# EasyEDA schematic SCH_闹钟_2022-10-18.json
TITLE: Sheet_1; REV: 1.0; Date: 2022-10-18; Sheet: 1/1; Drawn By: 小周; Company: Your Company
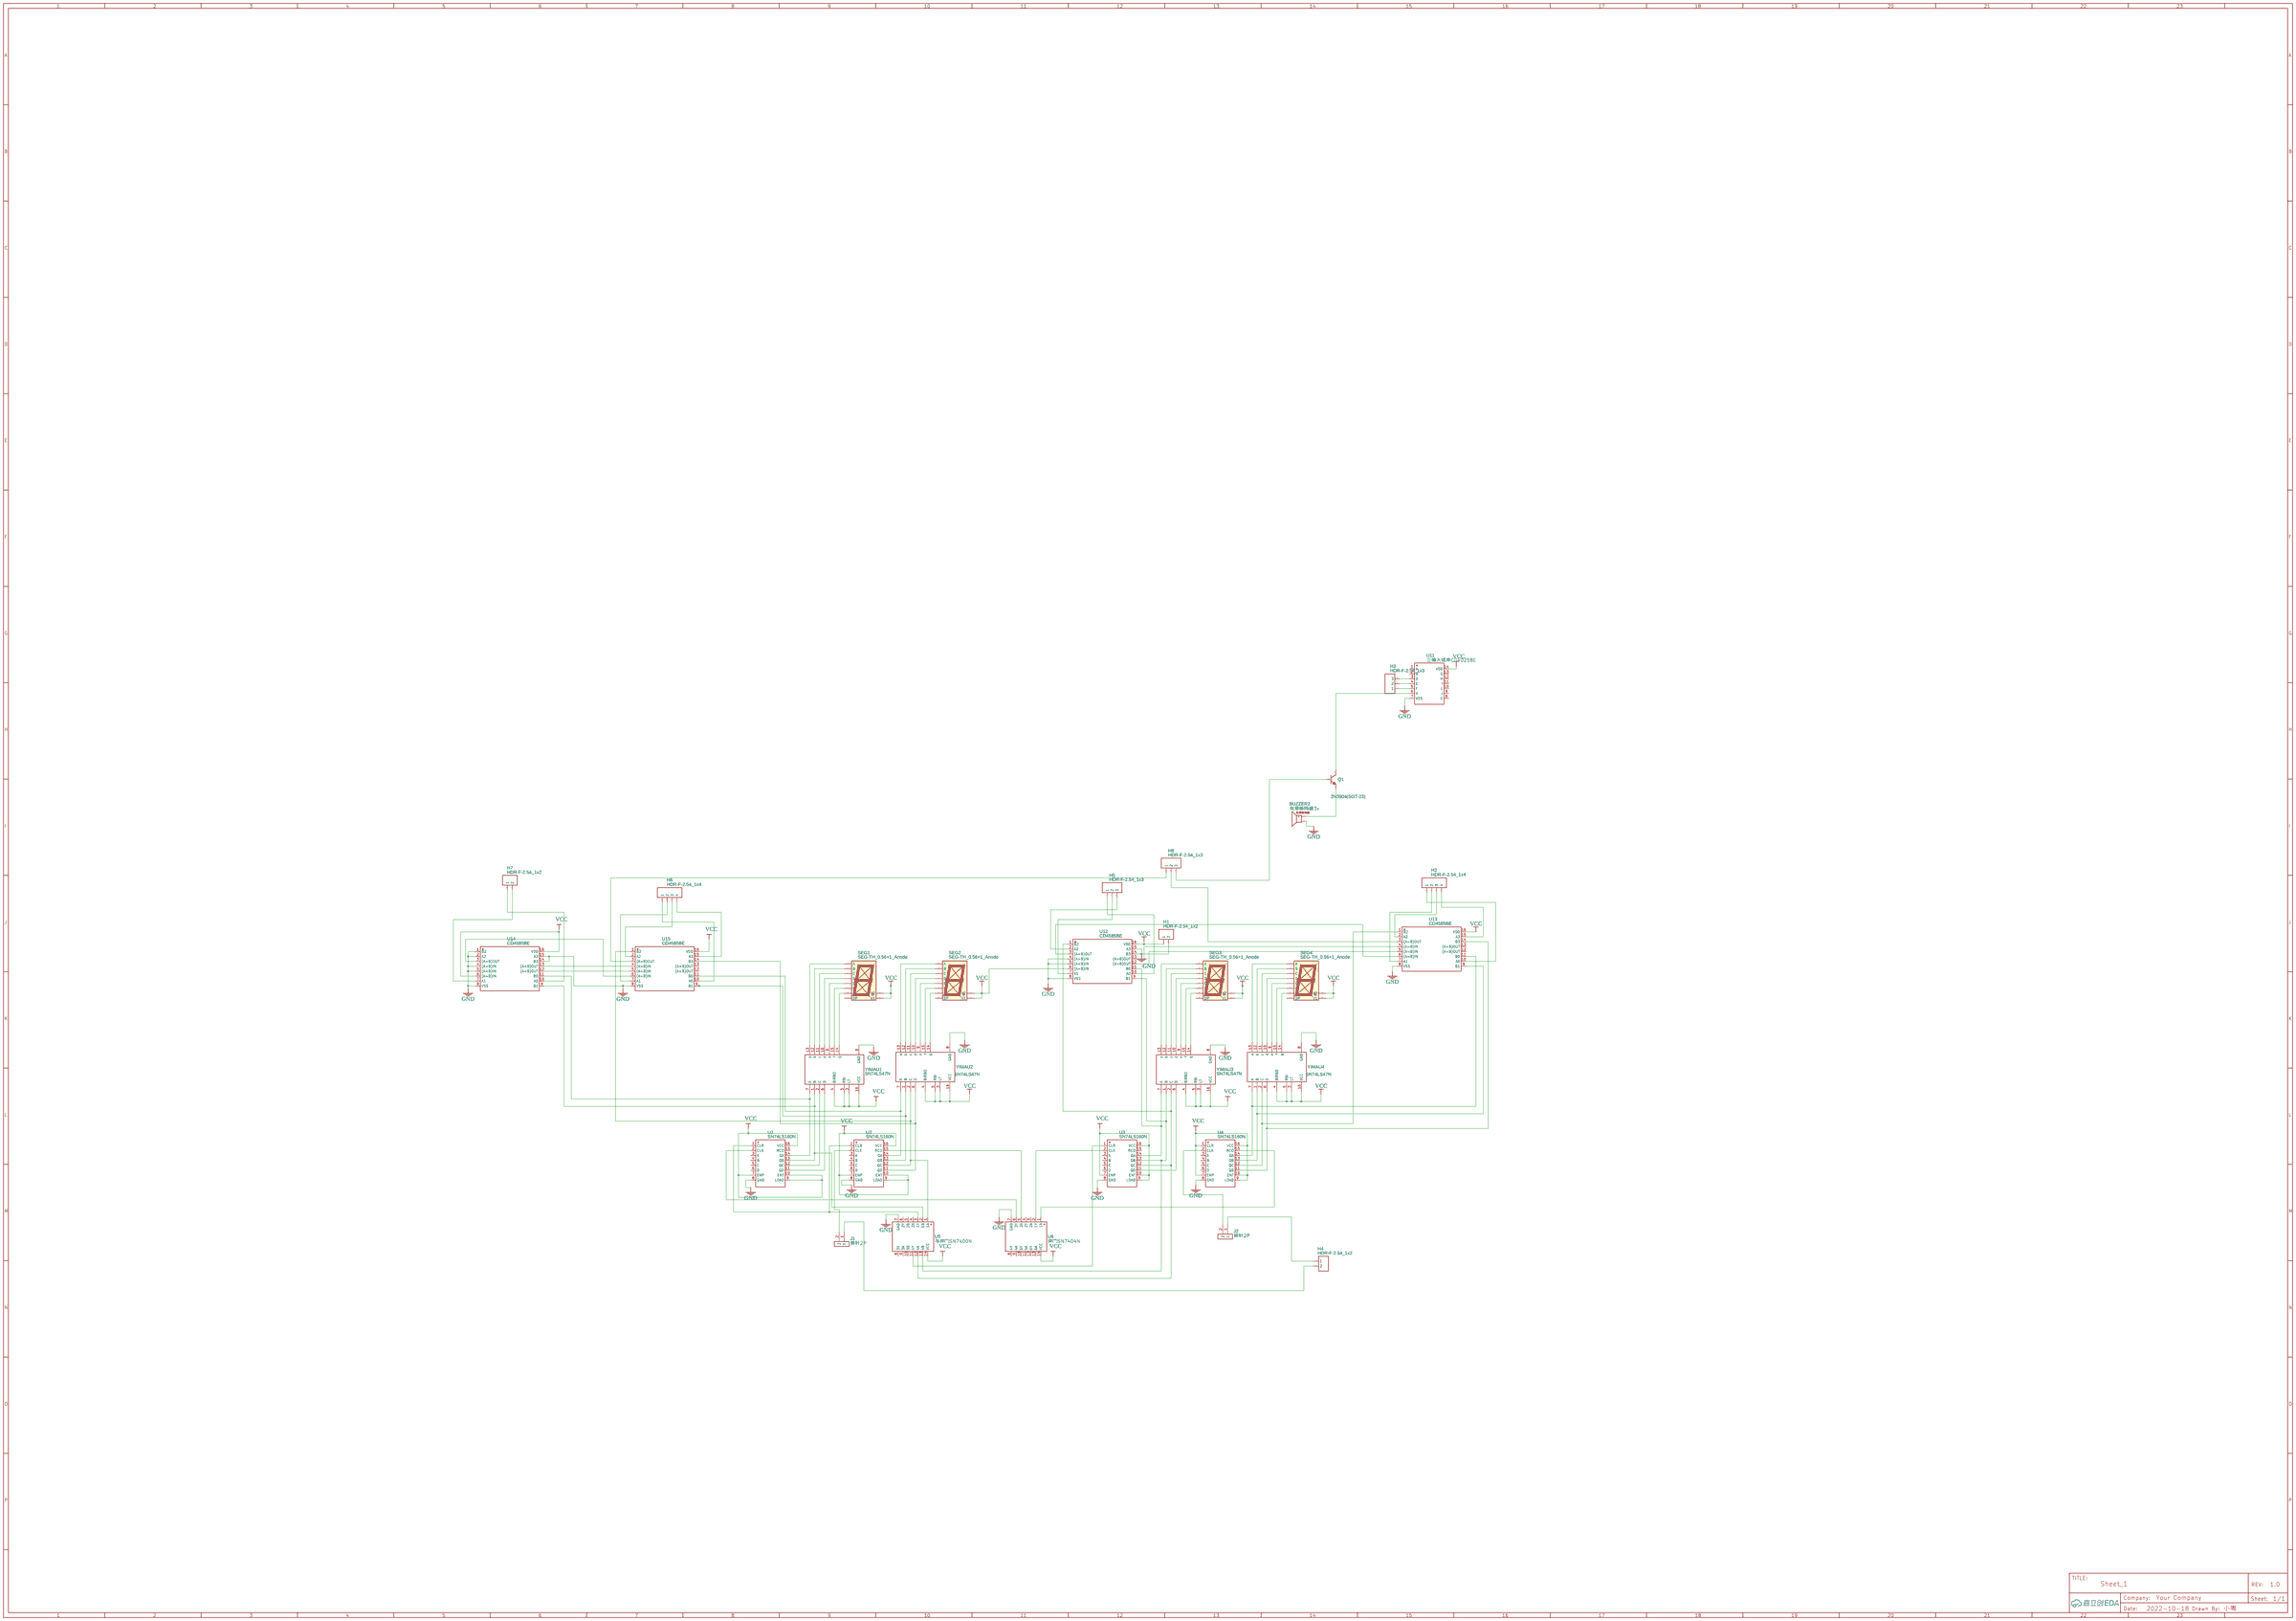
[diagram p0: schematic sheet]

## Parts
BUZZER2  有源蜂鸣器3v  [有源蜂鸣器3V]
H1  HDR-F-2.54_1x2  [HDR-F-2.54_1X2]
H2  HDR-F-2.54_1x4  [HDR-F-2.54_1X4]
H3  HDR-F-2.54_1x3  [HDR-F-2.54_1X3]
H4  HDR-F-2.54_1x2  [HDR-F-2.54_1X2]
H5  HDR-F-2.54_1x3  [HDR-F-2.54_1X3]
H6  HDR-F-2.54_1x4  [HDR-F-2.54_1X4]
H7  HDR-F-2.54_1x2  [HDR-F-2.54_1X2]
H8  HDR-F-2.54_1x3  [HDR-F-2.54_1X3]
J1  排针2P  [排针2P]
J2  排针2P  [排针2P]
Q1  2N3904(SOT-23)  [SOT-23-3_L2.9-W1.3-P1.90-LS2.4-TR]
SEG1  SEG-TH_0.56×1_Anode  [LED-SEG-TH_10P-L12.6-W19.0-P2.54-S15.24-BL]
SEG2  SEG-TH_0.56×1_Anode  [LED-SEG-TH_10P-L12.6-W19.0-P2.54-S15.24-BL]
SEG3  SEG-TH_0.56×1_Anode  [LED-SEG-TH_10P-L12.6-W19.0-P2.54-S15.24-BL]
SEG4  SEG-TH_0.56×1_Anode  [LED-SEG-TH_10P-L12.6-W19.0-P2.54-S15.24-BL]
U1  SN74LS160N  [DIP-16]
U2  SN74LS160N  [DIP-16]
U3  SN74LS160N  [DIP-16]
U4  SN74LS160N  [DIP-16]
U5  与非门SN7400N  [DIP14]
U6  非门SN7404N  [DIP14]
U11  三输入或非CD4025BE  [DIP-14_L19.2-W6.6-P2.54-LS10.9-BL]
U12  CD4585BE  [DIP-16_L20.0-W6.4-P2.54-LS7.6-BL]
U13  CD4585BE  [DIP-16_L20.0-W6.4-P2.54-LS7.6-BL]
U14  CD4585BE  [DIP-16_L20.0-W6.4-P2.54-LS7.6-BL]
U15  CD4585BE  [DIP-16_L20.0-W6.4-P2.54-LS7.6-BL]
YIMAU1  SN74LS47N  [DIP-16]
YIMAU2  SN74LS47N  [DIP-16]
YIMAU3  SN74LS47N  [DIP-16]
YIMAU4  SN74LS47N  [DIP-16]

## Library data of the parts
BUZZER2 = 有源蜂鸣器3v: Supplier: LCSC; Manufacturer: HNDZ; Manufacturer Part: TMB12A12; Supplier Part: C96079; Contributor: yibeikele
H1 H4 H7 = HDR-F-2.54_1x2: Supplier Part: C49661; Supplier: LCSC; Contributor: LCEDA_Lib
H2 H6 = HDR-F-2.54_1x4: Supplier Part: C225501; Supplier: LCSC; Contributor: LCEDA_Lib
H3 H5 H8 = HDR-F-2.54_1x3: Supplier Part: C146690; Supplier: LCSC; Contributor: LCEDA_Lib
J1 J2 = 排针2P: Contributor: goodhello
Q1 = 2N3904(SOT-23): Supplier: LCSC; Manufacturer: KEC; Manufacturer Part: 2n3904S-RTK/PS; Supplier Part: C18536; Paste Type: SOT-23; Contributor: LCEDA_Lib
SEG1-SEG4 = SEG-TH_0.56×1_Anode: Manufacturer: 志浩; Supplier Part: C8092; Supplier: LCSC; Contributor: LCEDA_01
U1-U4 = SN74LS160N: Supplier: LCSC; Supplier Part: C113834; Manufacturer: YAGEO; Manufacturer Part: CC0805JRNPO9BN821; Contributor: LCSC
U5 = SN7400N: Contributor: sky1001
U6 = SN7404N
U11 = CD4025BE: Supplier: LCSC; Manufacturer: TI; Supplier Part: C28214; JLCPCB Part Class: Extended Part
U12-U15 = CD4585BE: Supplier: LCSC; Manufacturer: TI; Supplier Part: C31466; JLCPCB Part Class: Extended Part
YIMAU1-YIMAU4 = -: Supplier: LCSC; Manufacturer: TI; Contributor: LCSC; Supplier Part: C129379

## Nets
GND: BUZZER2.- H1.2 U1.8(GND) U2.8(GND) U3.8(GND) U4.8(GND) U5.7(GND) U6.7(GND) U11.7(VSS) U12.4((A>B)IN) U12.5((A<B)IN) U12.8(VSS) U12.14(B3) U12.15(A3) U13.8(VSS) U14.1(B2) U14.2(A2) U14.4((A>B)IN) U14.5((A<B)IN) U14.8(VSS) U14.14(B3) U14.15(A3) U15.8(VSS) YIMAU1.8(GND) YIMAU2.8(GND) YIMAU3.8(GND) YIMAU4.8(GND)
VCC: H1.1 SEG1.3(V1) SEG1.8(V2) SEG2.3(V1) SEG2.8(V2) SEG3.3(V1) SEG3.8(V2) SEG4.3(V1) SEG4.8(V2) U1.7(ENP) U1.9(LOAD) U1.10(ENT) U1.16(VCC) U2.7(ENP) U2.9(LOAD) U2.10(ENT) U2.16(VCC) U3.7(ENP) U3.9(LOAD) U3.10(ENT) U3.16(VCC) U4.1(CLR) U4.7(ENP) U4.9(LOAD) U4.10(ENT) U4.16(VCC) U5.14(VCC) U6.14(VCC) U11.14(VDD) U12.6((A=B)IN) U12.16(VDD) U13.16(VDD) U14.6((A=B)IN) U14.16(VDD) U15.16(VDD) YIMAU1.3(LT) YIMAU1.4(BIRBO) YIMAU1.5(RBI) YIMAU1.16(VCC) YIMAU2.3(LT) YIMAU2.4(BIRBO) YIMAU2.5(RBI) YIMAU2.16(VCC) YIMAU3.3(LT) YIMAU3.4(BIRBO) YIMAU3.5(RBI) YIMAU3.16(VCC) YIMAU4.3(LT) YIMAU4.4(BIRBO) YIMAU4.5(RBI) YIMAU4.16(VCC)
Net-(BUZZER2-+): BUZZER2.+ Q1.1(E)
Net-(H2-1): H2.1 U13.10(A0)
Net-(H2-2): H2.2 U13.7(A1)
Net-(H2-3): H2.3 U13.2(A2)
Net-(H2-4): H2.4 U13.15(A3)
Net-(H3-1): H3.1 U11.5(F)
Net-(H3-2): H3.2 U11.4(E)
Net-(H3-3): H3.3 U11.3(D)
Net-(H4-1): H4.1 J2.1
Net-(H4-2): H4.2 J1.1
Net-(H5-1): H5.1 U12.10(A0)
Net-(H5-2): H5.2 U12.7(A1)
Net-(H5-3): H5.3 U12.2(A2)
Net-(H6-1): H6.1 U15.10(A0)
Net-(H6-2): H6.2 U15.7(A1)
Net-(H6-3): H6.3 U15.2(A2)
Net-(H6-4): H6.4 U15.15(A3)
Net-(H7-1): H7.1 U14.10(A0)
Net-(H7-2): H7.2 U14.7(A1)
Net-(H8-1): H8.1 U15.3((A=B)OUT)
Net-(H8-2): H8.2 U13.3((A=B)OUT)
Net-(H8-3): H8.3 Q1.2(B)
Net-(J1-2): J1.2 U2.2(CLK)
Net-(J2-2): J2.2 U4.2(CLK)
Net-(Q1-3): Q1.3(C) U11.6(K)
Net-(SEG1-1): SEG1.1(E) YIMAU1.9(e)
Net-(SEG1-2): SEG1.2(D) YIMAU1.10(d)
Net-(SEG1-4): SEG1.4(C) YIMAU1.11(c)
Net-(SEG1-6): SEG1.6(B) YIMAU1.12(b)
Net-(SEG1-7): SEG1.7(A) YIMAU1.13(a)
Net-(SEG1-9): SEG1.9(F) YIMAU1.15(f)
Net-(SEG1-10): SEG1.10(G) YIMAU1.14(g)
Net-(SEG2-1): SEG2.1(E) YIMAU2.9(e)
Net-(SEG2-2): SEG2.2(D) YIMAU2.10(d)
Net-(SEG2-4): SEG2.4(C) YIMAU2.11(c)
Net-(SEG2-6): SEG2.6(B) YIMAU2.12(b)
Net-(SEG2-7): SEG2.7(A) YIMAU2.13(a)
Net-(SEG2-9): SEG2.9(F) YIMAU2.15(f)
Net-(SEG2-10): SEG2.10(G) YIMAU2.14(g)
Net-(SEG3-1): SEG3.1(E) YIMAU3.9(e)
Net-(SEG3-2): SEG3.2(D) YIMAU3.10(d)
Net-(SEG3-4): SEG3.4(C) YIMAU3.11(c)
Net-(SEG3-6): SEG3.6(B) YIMAU3.12(b)
Net-(SEG3-7): SEG3.7(A) YIMAU3.13(a)
Net-(SEG3-9): SEG3.9(F) YIMAU3.15(f)
Net-(SEG3-10): SEG3.10(G) YIMAU3.14(g)
Net-(SEG4-1): SEG4.1(E) YIMAU4.9(e)
Net-(SEG4-2): SEG4.2(D) YIMAU4.10(d)
Net-(SEG4-4): SEG4.4(C) YIMAU4.11(c)
Net-(SEG4-6): SEG4.6(B) YIMAU4.12(b)
Net-(SEG4-7): SEG4.7(A) YIMAU4.13(a)
Net-(SEG4-9): SEG4.9(F) YIMAU4.15(f)
Net-(SEG4-10): SEG4.10(G) YIMAU4.14(g)
Net-(U1-1): U1.1(CLR) U2.1(CLR) U5.3(1Y)
Net-(U1-2): U1.2(CLK) U6.6(3Y)
Net-(U1-11): U1.11(QD) YIMAU1.6(D)
Net-(U1-12): U1.12(QC) YIMAU1.2(C)
Net-(U1-13): U1.13(QB) U5.2(1B) U14.9(B1) YIMAU1.1(B)
Net-(U1-14): U1.14(QA) U14.11(B0) YIMAU1.7(A)
Net-(U2-11): U2.11(QD) U15.14(B3) YIMAU2.6(D)
Net-(U2-12): U2.12(QC) U5.1(1A) U15.1(B2) YIMAU2.2(C)
Net-(U2-13): U2.13(QB) U15.9(B1) YIMAU2.1(B)
Net-(U2-14): U2.14(QA) U15.11(B0) YIMAU2.7(A)
Net-(U2-15): U2.15(RCO) U6.5(3A)
Net-(U3-1): U3.1(CLR) U5.11(4Y)
Net-(U3-2): U3.2(CLK) U6.2(1Y)
Net-(U3-11): U3.11(QD) YIMAU3.6(D)
Net-(U3-12): U3.12(QC) U5.12(4A) U12.1(B2) YIMAU3.2(C)
Net-(U3-13): U3.13(QB) U5.13(4B) U12.9(B1) YIMAU3.1(B)
Net-(U3-14): U3.14(QA) U12.11(B0) YIMAU3.7(A)
Net-(U4-11): U4.11(QD) U13.14(B3) YIMAU4.6(D)
Net-(U4-12): U4.12(QC) U13.1(B2) YIMAU4.2(C)
Net-(U4-13): U4.13(QB) U13.9(B1) YIMAU4.1(B)
Net-(U4-14): U4.14(QA) U13.11(B0) YIMAU4.7(A)
Net-(U4-15): U4.15(RCO) U6.1(1A)
Net-(U12-3): U12.3((A=B)OUT) U13.6((A=B)IN)
Net-(U12-12): U12.12((A<B)OUT) U13.5((A<B)IN)
Net-(U12-13): U12.13((A>B)OUT) U13.4((A>B)IN)
Net-(U14-3): U14.3((A=B)OUT) U15.6((A=B)IN)
Net-(U14-12): U14.12((A<B)OUT) U15.5((A<B)IN)
Net-(U14-13): U14.13((A>B)OUT) U15.4((A>B)IN)

Not connected (* = marked no-connect by the designer): SEG1 5(DP); SEG2 5(DP); SEG3 5(DP); SEG4 5(DP); U1 3(A) 4(B) 5(C) 6(D) 15(RCO); U2 3(A) 4(B) 5(C) 6(D); U3 3(A) 4(B) 5(C) 6(D) 15(RCO); U4 3(A) 4(B) 5(C) 6(D); U5 4(2A) 5(2B) 6(2Y) 8(3Y) 9(3A) 10(3B); U6 3(2A) 4(2Y) 8(4Y) 9(4A) 10(5Y) 11(5A) 12(6Y) 13(6A); U11 1(A) 2(B) 8(C) 9(J) 10(L) 11(I) 12(H) 13(G); U13 12((A<B)OUT) 13((A>B)OUT); U15 12((A<B)OUT) 13((A>B)OUT)
